# EasyEDA Pro project EMPEL_BkBstPCB.eprj

# Schematic Schematic1
Board Name: Board1; Create Date: 2025-07-24; Page Name: P1; Project Name: A new project; Schematic Name: Schematic1; Update Date: 2026-03-24; Company: EasyEDA.com; Page Size: A4; Version: V1.0
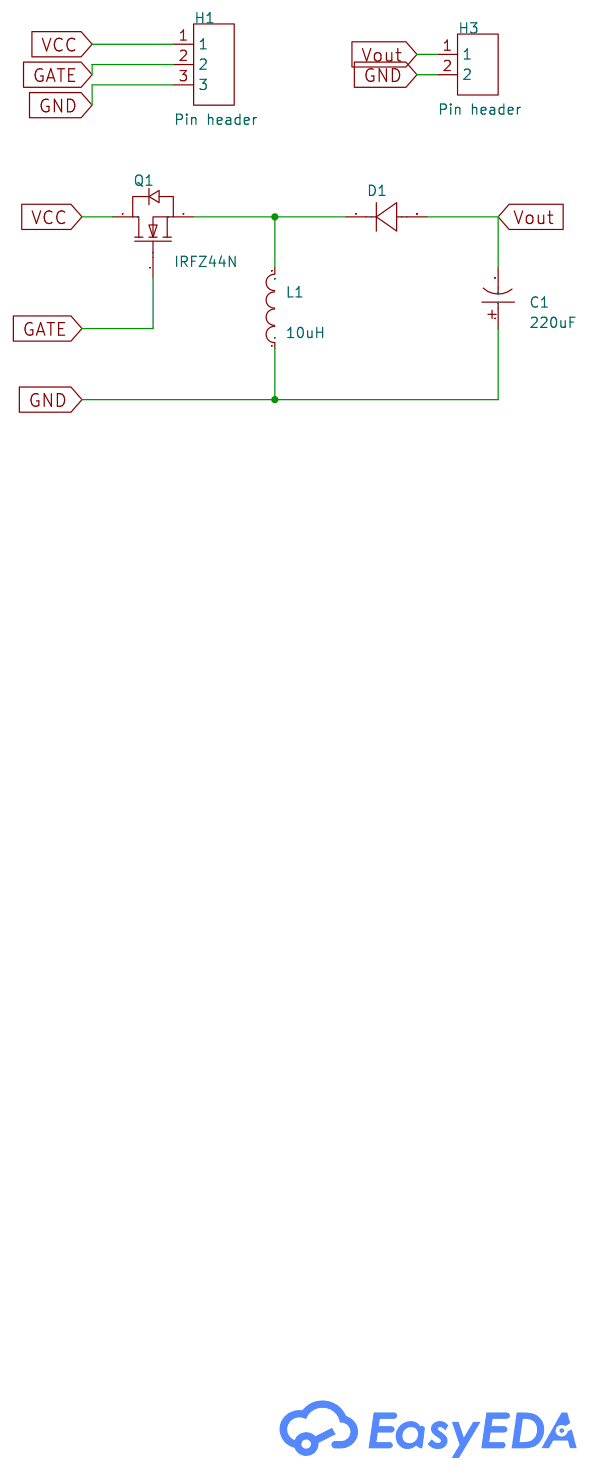
[diagram p0: schematic sheet]

## Parts
C1  220uF  [CAP-TH_BD10.0-P5.00-D1.0-FD]
D1  -  [power diode]
H1  Pin header  [HDR-TH_3P-P2.54-V-M-1]
H3  Pin header  [HDR-TH_2P-P2.54-V-M]
L1  10uH  [Inductor_sitting]
Q1  IRFZ44N  [TO-220-3_L9.9-W4.5-P2.54-L]

## Library data of the parts
C1 = 50PX220MEFC10X12.5: LCSC Part Name: 220uF ±20% 50V; Supplier Part: C88723; Manufacturer: Rubycon(红宝石); Supplier Footprint: 插件,D10xL12.5mm; JLCPCB Part Class: Extended Part; Datasheet: https://item.szlcsc.com/datasheet/50PX220MEFC10X12.5/89903.html; Supplier: LCSC; Tolerance: ±20%; Voltage Rating: 50V; Pin Spacing: 5mm; Diameter: 10mm; Height - Seated (Max): 12.5mm; Lifetime: 2000hrs@105℃; Operating Temperature: -25℃~+105℃
D1 = 1N4007: Supplier Footprint: SMA(DO-214AC); Supplier Part: C727081
H1 = HX PH254-01-03-Z-L11.5 pcb pin header: Pin Structure:1x3P Pitch:2.54mm Circluar Pins/Square Pins:Pin Header Mounting Type:Through Hole Number of Rows:1 Number of Pins:3P Current Rating:3A Voltage Rating (Max):1kV Length of Mating Pin:6mm Insulation Height:2.5mm Length of End Connection Pin:3mm; LCSC Part Name: 1x3P 间距:2.54mm 方针 直插; Supplier Part: C52016391; Manufacturer: hanxia(韩下); Supplier Footprint: 插件,P=2.54mm; JLCPCB Part Class: Extended Part; Datasheet: https://item.szlcsc.com/datasheet/HX%2520PH254-01-03-Z-L11.5%2520pcb%2520pin%2520header/54760436.html; Supplier: LCSC; Pin Structure: 1x3P; Pitch: 2.54mm; Circluar Pins/Square Pins: Pin Header; Mounting Type: Through Hole; Number of Rows: 1; Number of Pins: 3P; Current Rating: 3A; Voltage Rating (Max): 1kV; Length of Mating Pin: 6mm; Insulation Height: 2.5mm; Length of End Connection Pin: 3mm; Contact Material: Brass; Contact Plating: Gold; Operating Temperature: -40℃~+105℃
H3 = HX PH254-01-02-Z-L11.5 male header connector: Pin Structure:1x2P Pitch:2.54mm Circluar Pins/Square Pins:Pin Header Mounting Type:Through Hole Number of Rows:1 Number of Pins:2P Current Rating:3A Voltage Rating (Max):1kV Length of Mating Pin:6mm Insulation Height:2.5mm Length of End Connection Pin:3mm; LCSC Part Name: 1x2P 间距:2.54mm 方针 直插; Supplier Part: C52016390; Manufacturer: hanxia(韩下); Supplier Footprint: 插件,P=2.54mm; JLCPCB Part Class: Extended Part; Datasheet: https://item.szlcsc.com/datasheet/HX%2520PH254-01-02-Z-L11.5%2520male%2520header%2520connector/54760435.html; Supplier: LCSC; Pin Structure: 1x2P; Pitch: 2.54mm; Circluar Pins/Square Pins: Pin Header; Mounting Type: Through Hole; Number of Rows: 1; Number of Pins: 2P; Current Rating: 3A; Voltage Rating (Max): 1kV; Length of Mating Pin: 6mm; Insulation Height: 2.5mm; Length of End Connection Pin: 3mm; Contact Material: Brass; Contact Plating: Gold; Operating Temperature: -40℃~+105℃
L1 = L_0603: Supplier Footprint: L0603
Q1 = IRFZ44N: LCSC Part Name: 1个N沟道 耐压:60V 电流:60A; Supplier Part: C7429904; Manufacturer: minos(迈诺斯); Supplier Footprint: TO-220; JLCPCB Part Class: Extended Part; Datasheet: https://item.szlcsc.com/datasheet/IRFZ44N/8428625.html; Supplier: LCSC; Number: 1 N-Channel; Drain to Source Voltage: 60V; Current - Continuous Drain(Id): 60A; RDS(on): 12mΩ@10V,25A; Pd - Power Dissipation: 87W; Gate Threshold Voltage (Vgs(th)@Id): 3V; Gate Charge(Qg): 31nC@10V; Input Capacitance(Ciss): 910pF@25V; Reverse Transfer Capacitance (Crss@Vds): 30pF@25V; Operating Temperature: -55℃~+175℃@(Tj)

## Nets
GND: C1.1 H1.3 H3.2 L1.1
VCC: H1.1 Q1.2(D)
GATE: H1.2 Q1.1(G)
Vout: C1.2 D1.2(A) H3.1
$1N463: D1.1(K) L1.2 Q1.3(S)

# Board PCB1
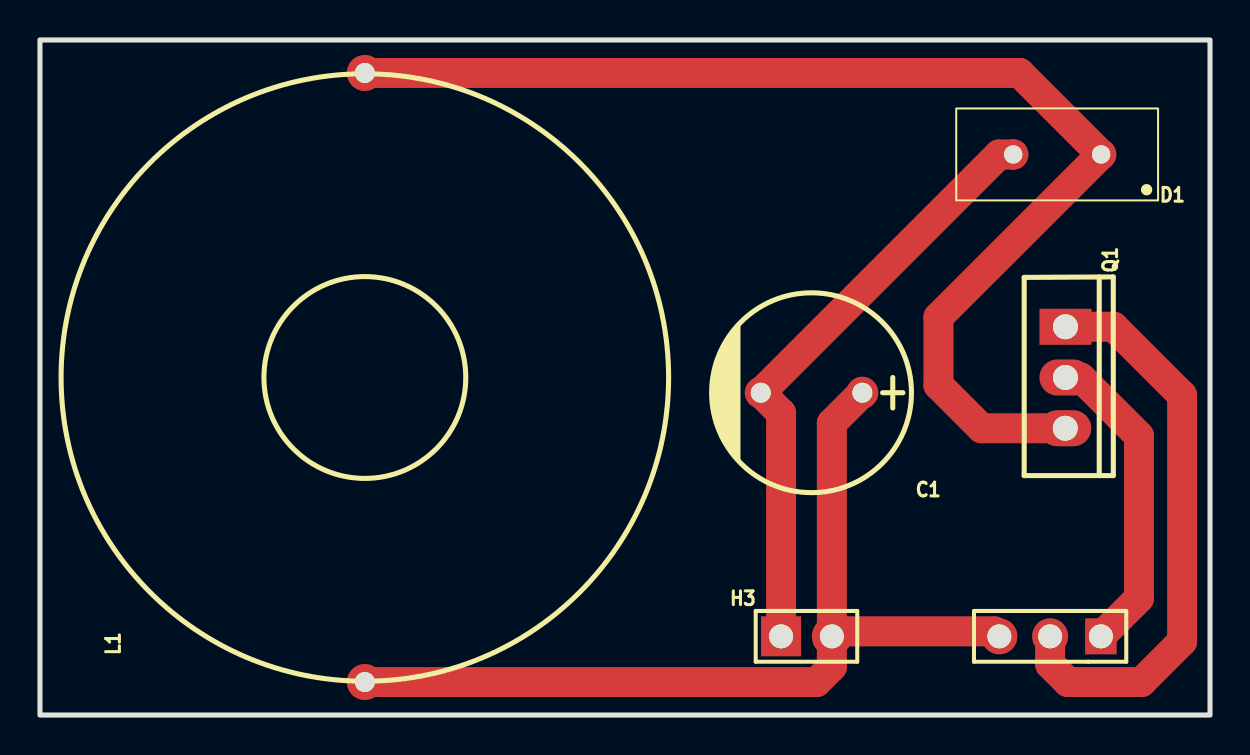
[diagram p1: board, top side]
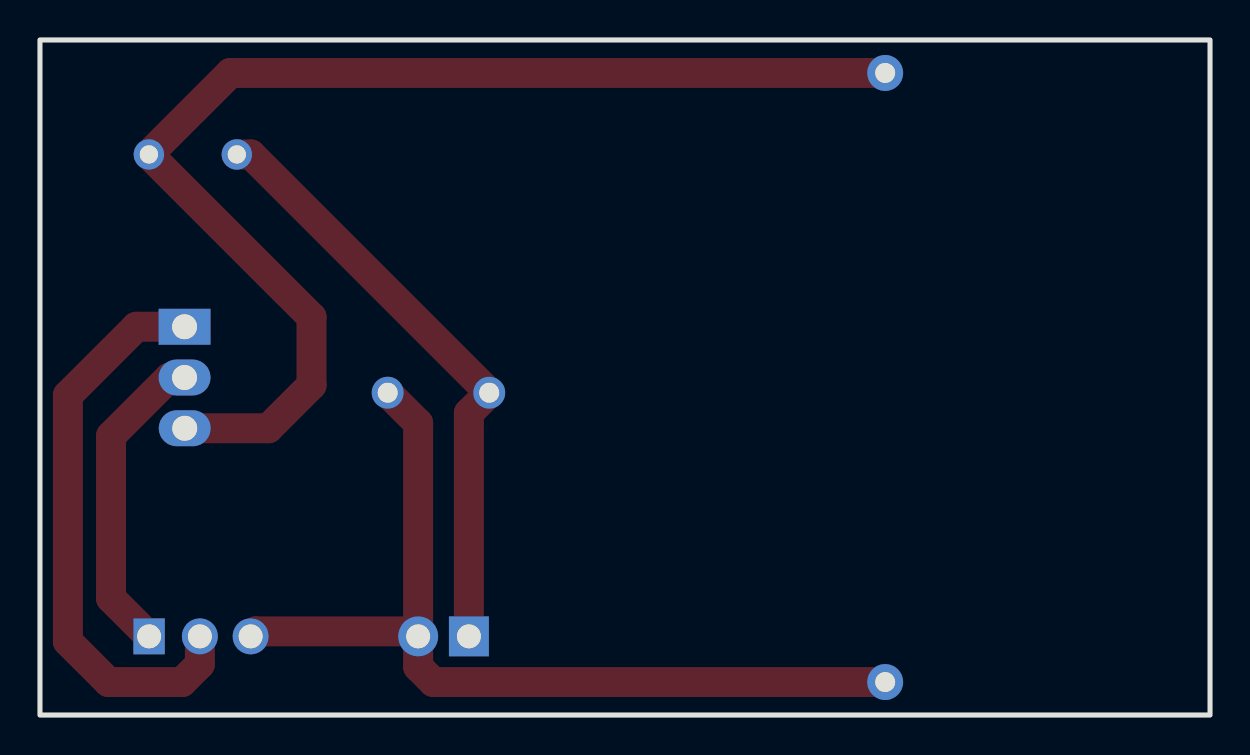
[diagram p2: board, bottom side, seen from below]

Outline 58.55 x 33.78 mm; copper layers: Top Layer, Bottom Layer. Coordinates in mm from the lower left corner of the outline.
Outline path: rectangle 0,33.78 58.55,0
Stack: Top Layer 0.035mm / Dielectric1 1.51mm FR4 er 4.5 / Bottom Layer 0.035mm

## Design rules (mm)
template: Custom Config
spacing copperThickness1oz (default): track to track 0.102, other pairs 0.152 to 0.3
spacing copperThickness2oz: track to track 0.203, other pairs 0.152 to 0.3
track width copperThickness1oz (default): min 0.127, default 1.5, max 2.54
track width copperThickness2oz: min 0.203, default 0.254, max 2.54
differential pair differentialPair (default): width min 0.127, default 0.254, max 2.54; gap min 0.152, default 0.152
via viaSize (default): diameter min 0.5, default 0.61, max 10; hole min 0.3, default 0.305, max 6.3

## Placement (name value [footprint] x y rotation side)
C1  220uF  [CAP-TH_BD10.0-P5.00-D1.0-FD]  38.61 16.13 180 top
D1  -  [power diode]  50.93 28.07 180 top
H1  Pin header  [HDR-TH_3P-P2.54-V-M-1]  50.55 3.94 180 top
H3  Pin header  [HDR-TH_2P-P2.54-V-M]  38.35 3.94 0 top
L1  10uH  [Inductor_sitting]  16.26 16.89 90 top
Q1  IRFZ44N  [TO-220-3_L9.9-W4.5-P2.54-L]  51.31 16.89 270 top

## Footprints (pads in the part's own frame, mm; a bottom-side part is the same pattern mirrored in y, then rotated)
CAP-TH_BD10.0-P5.00-D1.0-FD
  round 1.6 hole 1: 1(-2.54,0) 2(2.54,0)
HDR-TH_2P-P2.54-V-M
  rect 2x2 hole 1.2: 1(-1.27,0)
  round 2 hole 1.2: 2(1.27,0)
HDR-TH_3P-P2.54-V-M-1
  rect 1.575x1.8 hole 1.2: 1(-2.54,0)
  round 1.8 hole 1.2: 2(0,0) 3(2.54,0)
Inductor_sitting
  round 1.8 hole 1: 1(-15.24,0) 2(15.24,0)
power diode
  round 1.524 hole 0.914: 1(-2.17,0.014) 2(2.23,0.014)
TO-220-3_L9.9-W4.5-P2.54-L
  rect 1.8x2.6 hole 1.25: 1(-2.54,0.005)
  oval 1.8x2.6 hole 1.25: 2(0,0.005) 3(2.54,-0.005)

## Nets
As in the schematic, except:
VOUT: C1.2 D1.2 H3.1

## Routing (per net, layer and track width the routed paths; a pad name or vN(x,y) marks a point on that pad's centre or on a via; arc(x,y) is an arc through that point)
GND: length 46.5
  Top Layer w1.5: 48.01,3.94 47.76,4.19 39.62,4.19 ; 39.62,4.19 39.62,14.61 C1.1 ; 39.62,4.19 H3.2 39.62,2.41 38.86,1.65 L1.1
VCC: length 15.7
  Top Layer w1.5: H1.1 54.99,5.84 54.99,13.97 52.07,16.89 Q1.2
GATE: length 28.8
  Top Layer w1.5: Q1.1 53.72,19.43 57.15,16 57.15,3.68 55.12,1.65 51.43,1.65 50.55,2.54 H1.2
VOUT: length 30.2
  Top Layer w1.5: H3.1 37.08,15.11 C1.2 47.99,28.05 48.7,28.05
$1N463: length 60.7
  Top Layer w1.5: Q1.3 47.12,14.35 44.96,16.51 44.96,19.91 53.1,28.05 49.02,32.13 L1.2
